# EAGLE design PWM_Board (EAGLE 7.1.0)
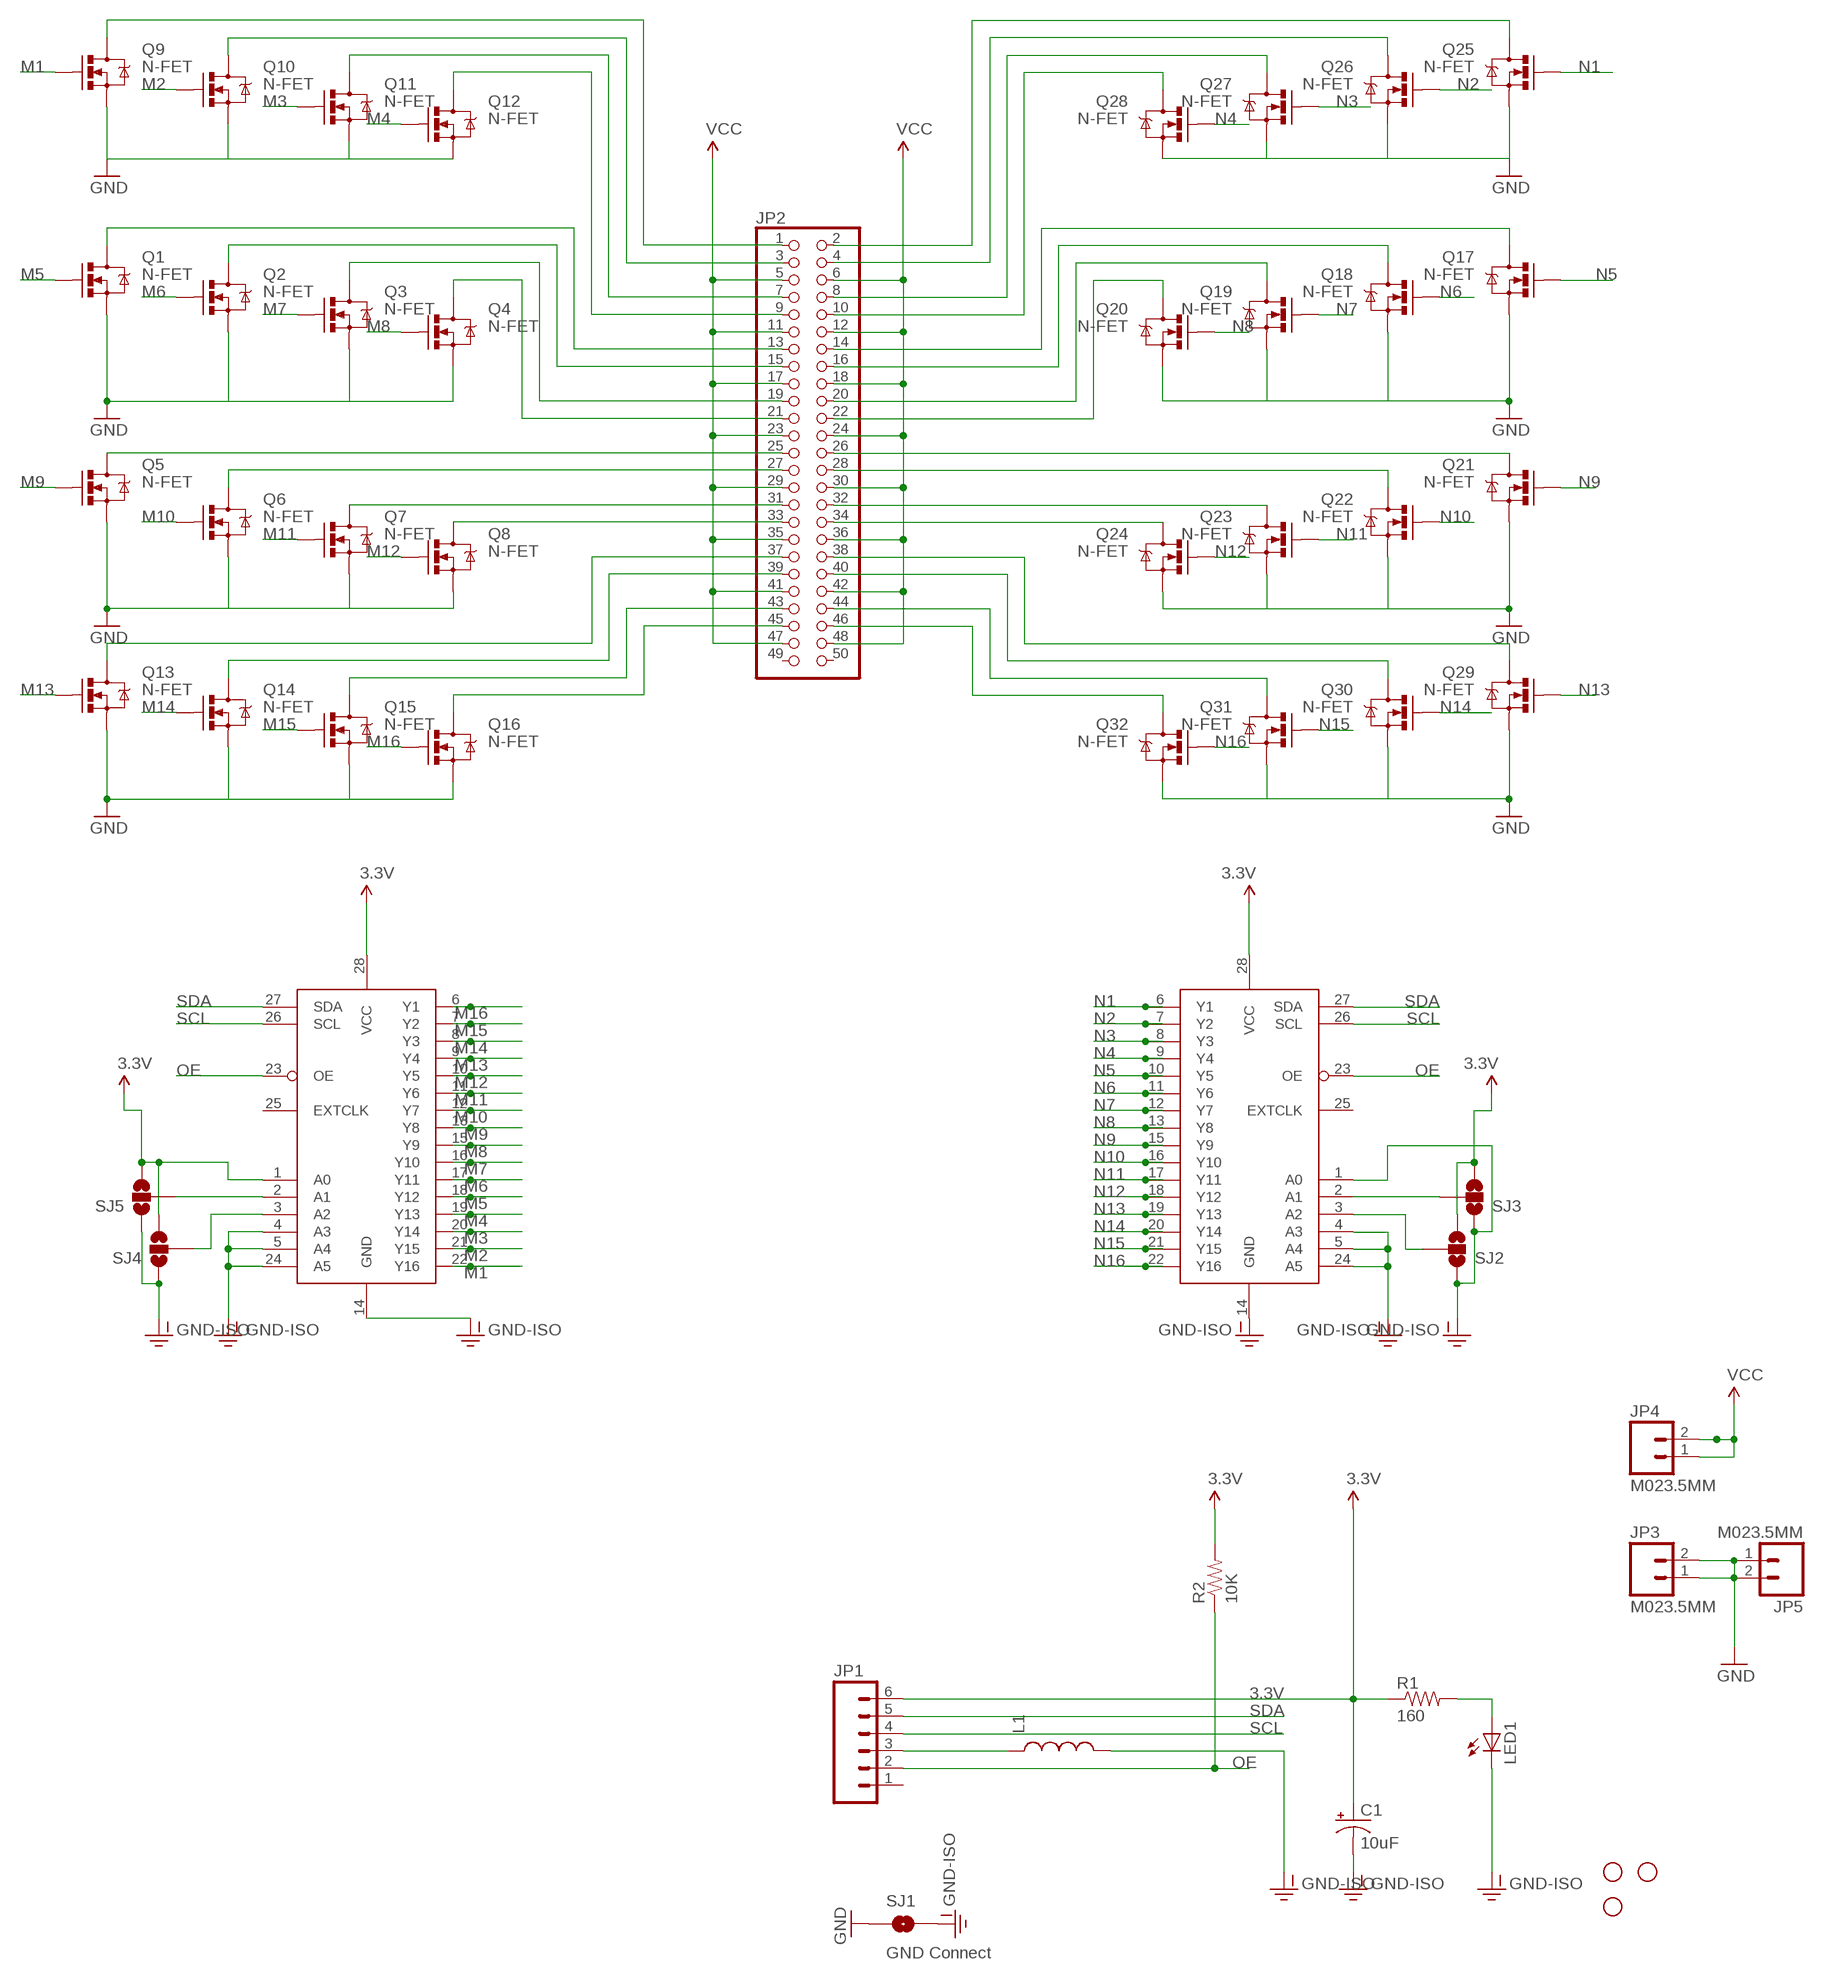
[diagram p0: schematic, sheet 1]

## Parts
C1  10uF  CAP_POL1206  [EIA3216]
JP1  M06POLAR  [MOLEX-1X6]
JP2  PINHD-2X25  [2X25]
JP3  M023.5MM  [SCREWTERMINAL-3.5MM-2]
JP4  M023.5MM  [SCREWTERMINAL-3.5MM-2]
JP5  M023.5MM  [SCREWTERMINAL-3.5MM-2]
L1  INDUCTOR1206H*  [INDUCTOR-1206]
LED1  LED-FKIT-1206  [FKIT-LED-1206]
Q1  N-FET  MOSFET-NCHANNELBSS138  [SOT23]
Q2  N-FET  MOSFET-NCHANNELBSS138  [SOT23]
Q3  N-FET  MOSFET-NCHANNELBSS138  [SOT23]
Q4  N-FET  MOSFET-NCHANNELBSS138  [SOT23]
Q5  N-FET  MOSFET-NCHANNELBSS138  [SOT23]
Q6  N-FET  MOSFET-NCHANNELBSS138  [SOT23]
Q7  N-FET  MOSFET-NCHANNELBSS138  [SOT23]
Q8  N-FET  MOSFET-NCHANNELBSS138  [SOT23]
Q9  N-FET  MOSFET-NCHANNELBSS138  [SOT23]
Q10  N-FET  MOSFET-NCHANNELBSS138  [SOT23]
Q11  N-FET  MOSFET-NCHANNELBSS138  [SOT23]
Q12  N-FET  MOSFET-NCHANNELBSS138  [SOT23]
Q13  N-FET  MOSFET-NCHANNELBSS138  [SOT23]
Q14  N-FET  MOSFET-NCHANNELBSS138  [SOT23]
Q15  N-FET  MOSFET-NCHANNELBSS138  [SOT23]
Q16  N-FET  MOSFET-NCHANNELBSS138  [SOT23]
Q17  N-FET  MOSFET-NCHANNELBSS138  [SOT23]
Q18  N-FET  MOSFET-NCHANNELBSS138  [SOT23]
Q19  N-FET  MOSFET-NCHANNELBSS138  [SOT23]
Q20  N-FET  MOSFET-NCHANNELBSS138  [SOT23]
Q21  N-FET  MOSFET-NCHANNELBSS138  [SOT23]
Q22  N-FET  MOSFET-NCHANNELBSS138  [SOT23]
Q23  N-FET  MOSFET-NCHANNELBSS138  [SOT23]
Q24  N-FET  MOSFET-NCHANNELBSS138  [SOT23]
Q25  N-FET  MOSFET-NCHANNELBSS138  [SOT23]
Q26  N-FET  MOSFET-NCHANNELBSS138  [SOT23]
Q27  N-FET  MOSFET-NCHANNELBSS138  [SOT23]
Q28  N-FET  MOSFET-NCHANNELBSS138  [SOT23]
Q29  N-FET  MOSFET-NCHANNELBSS138  [SOT23]
Q30  N-FET  MOSFET-NCHANNELBSS138  [SOT23]
Q31  N-FET  MOSFET-NCHANNELBSS138  [SOT23]
Q32  N-FET  MOSFET-NCHANNELBSS138  [SOT23]
R1  160  RESISTOR1206  [1206]
R2  10K  RESISTOR1206  [1206]
SJ1  GND Connect  SOLDERJUMPERNC  [SJ_2S]
SJ2  SOLDERJUMPER_2WAYS  [SJ_3]
SJ3  SOLDERJUMPER_2WAYS  [SJ_3]
SJ4  SOLDERJUMPER_2WAYS  [SJ_3]
SJ5  SOLDERJUMPER_2WAYS  [SJ_3]
STANDOFF1  STAND-OFF  [STAND-OFF]
STANDOFF3  STAND-OFF  [STAND-OFF]
STANDOFF4  STAND-OFF  [STAND-OFF]
U$2  PCA9685  [TSSOP28]
U$3  PCA9685  [TSSOP28]

## Nets
3.3V: C1.A(+) JP1.6 R1.1 R2.2 SJ2.3 SJ3.3 SJ4.3 SJ5.3 U$2.28(VCC) U$3.1(A0) U$3.28(VCC)
GND: JP3.1 JP3.2 JP5.1 JP5.2 Q1.2(S) Q2.2(S) Q3.2(S) Q4.2(S) Q5.2(S) Q6.2(S) Q7.2(S) Q8.2(S) Q9.2(S) Q10.2(S) Q11.2(S) Q12.2(S) Q13.2(S) Q14.2(S) Q15.2(S) Q16.2(S) Q17.2(S) Q18.2(S) Q19.2(S) Q20.2(S) Q21.2(S) Q22.2(S) Q23.2(S) Q24.2(S) Q25.2(S) Q26.2(S) Q27.2(S) Q28.2(S) Q29.2(S) Q30.2(S) Q31.2(S) Q32.2(S) SJ1.1
GND-ISO: C1.C(-) L1.P$2 LED1.C SJ1.2 SJ2.1 SJ3.1 SJ4.1 SJ5.1 U$2.1(A0) U$2.4(A3) U$2.5(A4) U$2.14(GND) U$2.24(A5) U$3.4(A3) U$3.5(A4) U$3.14(GND) U$3.24(A5)
M1: Q9.1(G) U$3.22(Y16)
M2: Q10.1(G) U$3.21(Y15)
M3: Q11.1(G) U$3.20(Y14)
M4: Q12.1(G) U$3.19(Y13)
M5: Q1.1(G) U$3.18(Y12)
M6: Q2.1(G) U$3.17(Y11)
M7: Q3.1(G) U$3.16(Y10)
M8: Q4.1(G) U$3.15(Y9)
M9: Q5.1(G) U$3.13(Y8)
M10: Q6.1(G) U$3.12(Y7)
M11: Q7.1(G) U$3.11(Y6)
M12: Q8.1(G) U$3.10(Y5)
M13: Q13.1(G) U$3.9(Y4)
M14: Q14.1(G) U$3.8(Y3)
M15: Q15.1(G) U$3.7(Y2)
M16: Q16.1(G) U$3.6(Y1)
N1: Q25.1(G) U$2.6(Y1)
N2: Q26.1(G) U$2.7(Y2)
N3: Q27.1(G) U$2.8(Y3)
N4: Q28.1(G) U$2.9(Y4)
N5: Q17.1(G) U$2.10(Y5)
N6: Q18.1(G) U$2.11(Y6)
N7: Q19.1(G) U$2.12(Y7)
N8: Q20.1(G) U$2.13(Y8)
N9: Q21.1(G) U$2.15(Y9)
N10: Q22.1(G) U$2.16(Y10)
N11: Q23.1(G) U$2.17(Y11)
N12: Q24.1(G) U$2.18(Y12)
N13: Q29.1(G) U$2.19(Y13)
N14: Q30.1(G) U$2.20(Y14)
N15: Q31.1(G) U$2.21(Y15)
N16: Q32.1(G) U$2.22(Y16)
N$1: JP1.3 L1.P$1
N$2: JP2.1 Q9.3(D)
N$3: JP2.3 Q10.3(D)
N$4: JP2.7 Q11.3(D)
N$5: JP2.9 Q12.3(D)
N$6: JP2.13 Q1.3(D)
N$7: JP2.15 Q2.3(D)
N$8: JP2.19 Q3.3(D)
N$9: JP2.21 Q4.3(D)
N$10: JP2.25 Q5.3(D)
N$11: LED1.A R1.2
N$12: JP2.27 Q6.3(D)
N$13: JP2.31 Q7.3(D)
N$14: JP2.33 Q8.3(D)
N$15: JP2.37 Q13.3(D)
N$16: JP2.39 Q14.3(D)
N$17: JP2.43 Q15.3(D)
N$18: JP2.45 Q16.3(D)
N$23: JP2.2 Q25.3(D)
N$24: JP2.4 Q26.3(D)
N$25: JP2.8 Q27.3(D)
N$26: JP2.10 Q28.3(D)
N$27: JP2.14 Q17.3(D)
N$28: JP2.16 Q18.3(D)
N$29: JP2.20 Q19.3(D)
N$30: JP2.22 Q20.3(D)
N$31: JP2.26 Q21.3(D)
N$32: JP2.28 Q22.3(D)
N$33: JP2.32 Q23.3(D)
N$34: JP2.34 Q24.3(D)
N$35: JP2.38 Q29.3(D)
N$36: JP2.40 Q30.3(D)
N$37: JP2.44 Q31.3(D)
N$38: JP2.46 Q32.3(D)
N$44: SJ3.2 U$2.2(A1)
N$45: SJ2.2 U$2.3(A2)
N$47: SJ5.2 U$3.2(A1)
N$48: SJ4.2 U$3.3(A2)
OE: JP1.2 R2.1 U$2.23(OE) U$3.23(OE)
SCL: JP1.4 U$2.26(SCL) U$3.26(SCL)
SDA: JP1.5 U$2.27(SDA) U$3.27(SDA)
VCC: JP2.5 JP2.6 JP2.11 JP2.12 JP2.17 JP2.18 JP2.23 JP2.24 JP2.29 JP2.30 JP2.35 JP2.36 JP2.41 JP2.42 JP2.47 JP2.48 JP4.1 JP4.2
Unconnected: JP1.1 JP2.49 JP2.50 U$2.25(EXTCLK) U$3.25(EXTCLK)

## Library data of the parts
C1 = 1_SparkFun-Capacitors:CAP_POL: Capacitor Polarized These are standard SMD and PTH capacitors. Normally 10uF, 47uF, and 100uF in electrolytic and tantalum varieties. Always verify the external diameter of the through hole cap, it varies with capacity, voltage, and manufacturer. The EIA devices should be standard.
JP1 = 1_SparkFun-Connectors:M06: Header 6 Standard 6-pin 0.1" header. Use with straight break away headers (SKU : PRT-00116), right angle break away headers (PRT-00553), swiss pins (PRT-00743), machine pins (PRT-00117), and female headers (PRT-00115). Molex polarized connector foot print use with SKU : PRT-08094 with associated crimp pins and housings. NOTES ON THE VARIANTS LOCK and LOCK_LONGPADS... This footprint was designed to help hold the alignment of a through-hole component (i.e. 6-pin header) while soldering it into place. You may notice that each hole has been shifted either up or down by 0.005 of an inch from it's more standard position (which is a perfectly straight line). This slight alteration caused the pins (the squares in the middle) to touch the edges of the holes. Because they are alternating, it causes a "brace" to hold the component in place. 0.005 has proven to be the perfect amount of "off-center" position when using our standard breakaway headers. Although looks a little odd when you look at the bare footprint, once you have a header in there, the alteration is very hard to notice. Also,if you push a header all the way into place, it is covered up entirely on the bottom side. This idea of altering the position of holes to aid alignment will be further integrated into the Sparkfun Library for other footprints. It can help hold any component with 3 or more connection pins.
JP2 = pinhead:PINHD-2X25: PIN HEADER
JP3-JP5 = 1_SparkFun-Connectors:M02: Standard 2-pin 0.1" header. Use with - straight break away headers ( PRT-00116) - right angle break away headers (PRT-00553) - swiss pins (PRT-00743) - machine pins (PRT-00117) - female headers (PRT-00115) Molex polarized connector foot print use with: PRT-08233 with associated crimp pins and housings. 2.54_SCREWTERM for use with PRT-10571. 3.5mm Screw Terminal footprints for PRT-08084 5mm Screw Terminal footprints for use with PRT-08433
L1 = 1_SparkFun-Passives:INDUCTOR: Inductors Basic Inductor/Choke - 0603 and 1206. Footprints are not proven and vary greatly between part numbers. SRN6045- 33uH, 20% 1.4A SDR0403-560KL - 56uH, 10%, 500mA RMS/740mA peak
LED1 = 1_SparkFun-LED:LED: LEDs Standard schematic elements and footprints for 5mm, 3mm, 1206, and 0603 sized LEDs. 5mm - Spark Fun Electronics SKU : COM-00529 (and others)
Q1-Q32 = 1_SparkFun-DiscreteSemi:MOSFET-NCHANNEL: Common NMOSFET Parts MFG P/N Store ID Prod ID FDD8780 TRANS-09984 SI7820DN TRANS-11055 FDS6630A IC-08089 2N7002PW TRANS-11151 FQP30N06L COM-10213 TRANS-10060 BSS123LT1G TRANS-08345 BSS138 TRANS-00830 BS170 2N7000; PROD_ID: TRANS-00830
R1 R2 = 1_SparkFun-Resistors:RESISTOR: Resistor Basic schematic elements and footprints for 0603, 1206, and PTH resistors.
SJ1 = 1_SparkFun-Passives:SOLDERJUMPER: Solder Jumper Standard SMD solder jumper. Used to automate production. Two varients : Normally Open and Normally Closed are the same, but have different paste layers. NC will have a large amount of paste and should jumper during reflow.
SJ2-SJ5 = 1_SparkFun-Passives:SOLDERJUMPER_2WAY: Solder Jumper 2 way solder jumper
STANDOFF1 STANDOFF3 STANDOFF4 = 1_SparkFun-Electromechanical:STAND-OFF: #4 Stand Off This is the mechanical footprint for a #4 phillips button head screw. Use the keepout ring to avoid running the screw head into surrounding components. SKU : PRT-00447
U$2 U$3 = 0_Tristan's_Lib:PCA9685

## Board
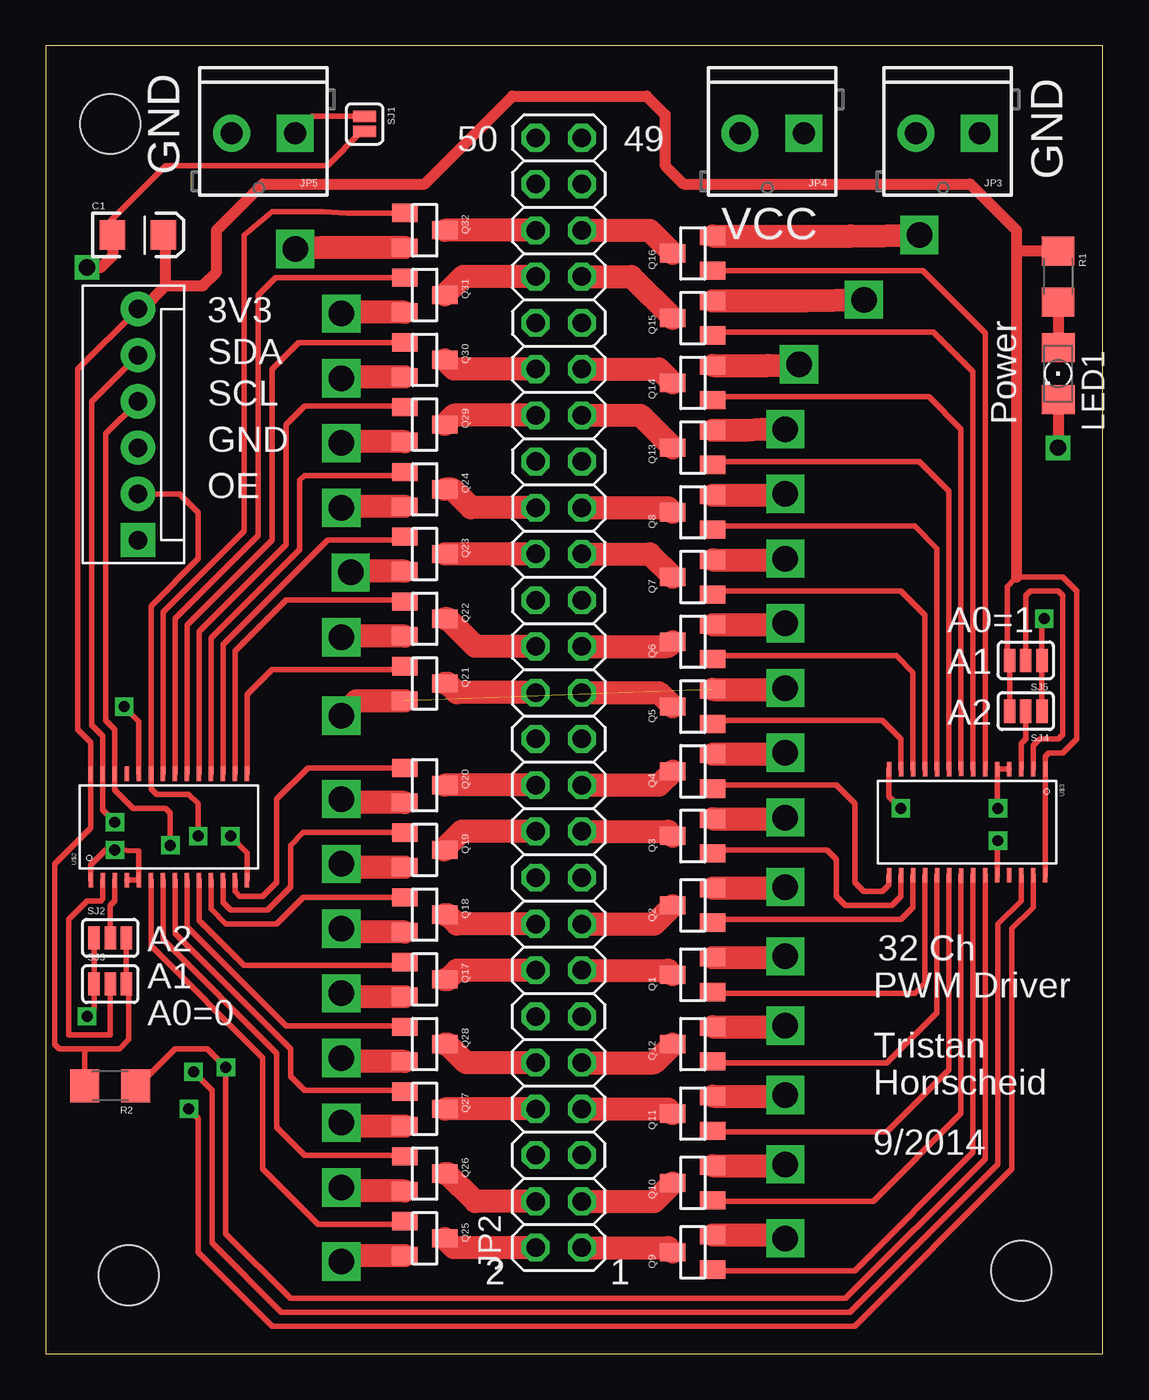
[diagram p1: board, top side]
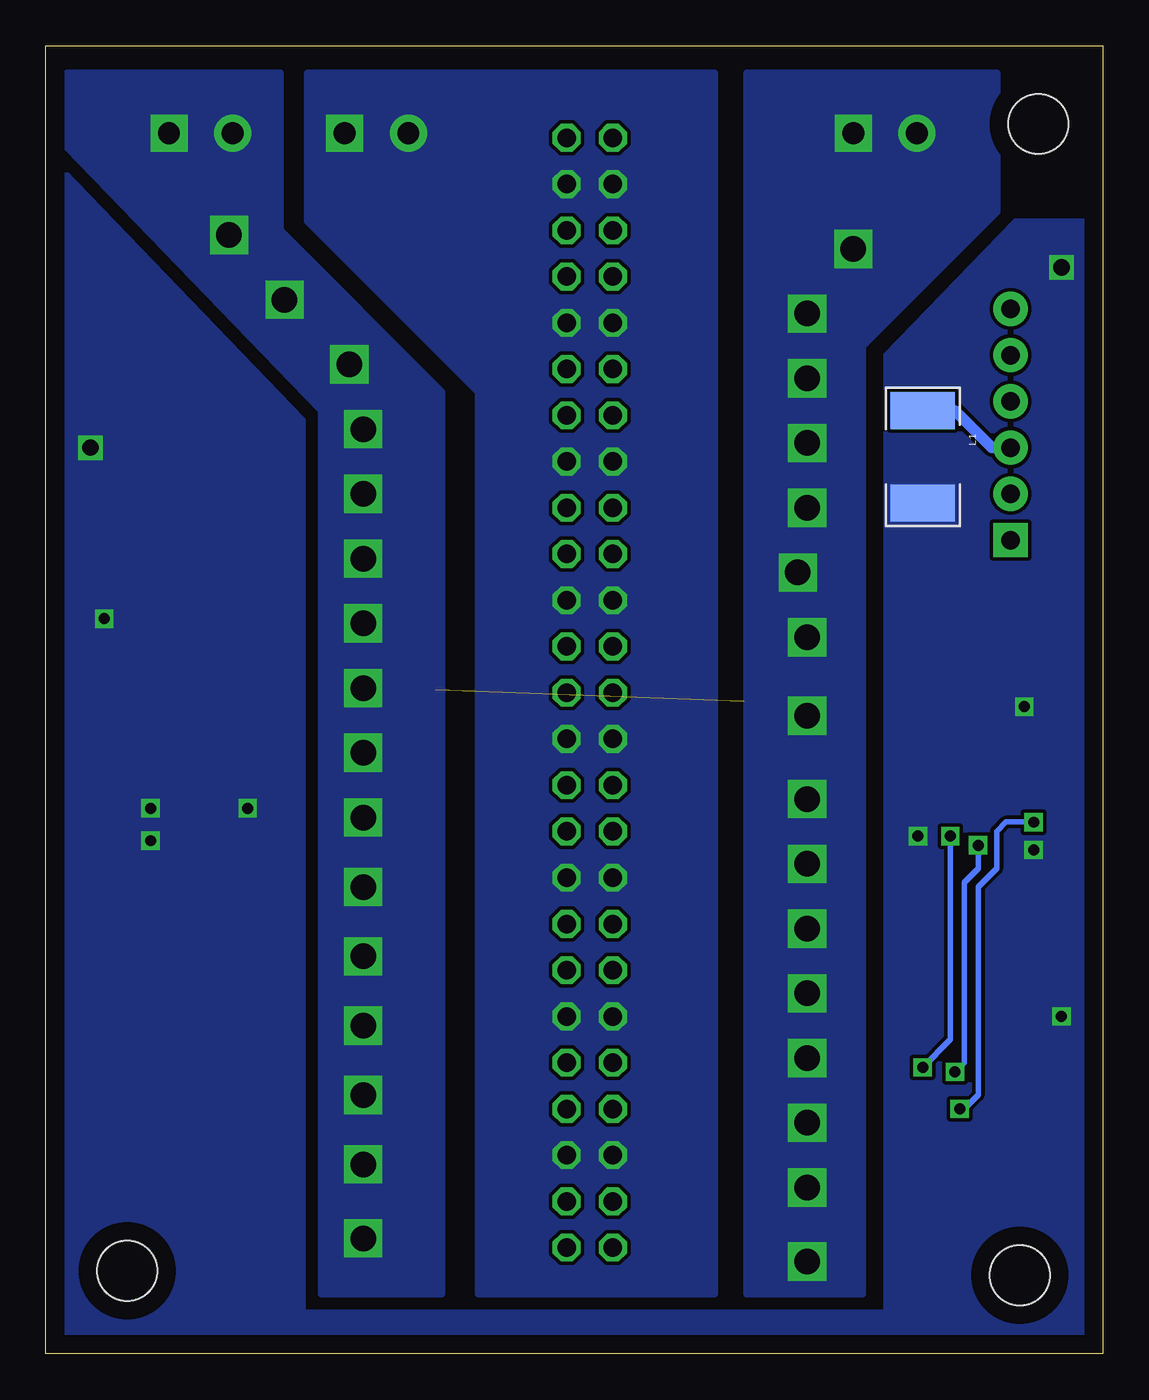
[diagram p2: board, bottom side, seen from below]

Size 58.09 x 71.87 mm. Coordinates in mm from the lower left corner, seen from the top.
Outline: 0,0 58.09,0 58.09,71.87 0,71.87 0,0
Copper layers (1*16): Top 0.035mm / dielectric 1.5mm / Bottom 0.035mm
Design rules "default": minimum track width 10mil, minimum drill 24mil, track to track 8mil, track to pad 8mil, pad to pad 8mil, via to via 8mil, smd to smd 8mil, copper to edge 40mil, drill to drill 8mil, minimum pad ring 10mil, minimum via ring 8mil, stop-mask expansion 4mil, vias tented up to drill 0mil, thermal gap 10mil

### Footprints (pad centres in the part's own frame; a part is rotated, then mirrored left to right if it is on the bottom)
EIA3216 = smd 1.4 x 1.6: A 1.4,0; C -1.4,0
MOLEX-1X6 = drill 1.016 pad 1.88 square: 1 0,0 | drill 1.016 pad 1.88: 2 2.54,0; 3 5.08,0; 4 7.62,0; 5 10.16,0; 6 12.7,0
2X25 = drill 1.016 octagon: 1 -30.48,-1.27; 2 -30.48,1.27; 3 -27.94,-1.27; 4 -27.94,1.27; 5 -25.4,-1.27; 6 -25.4,1.27; 7 -22.86,-1.27; 8 -22.86,1.27; 9 -20.32,-1.27; 10 -20.32,1.27; 11 -17.78,-1.27; 12 -17.78,1.27; 13 -15.24,-1.27; 14 -15.24,1.27; 15 -12.7,-1.27; 16 -12.7,1.27; 17 -10.16,-1.27; 18 -10.16,1.27; 19 -7.62,-1.27; 20 -7.62,1.27; 21 -5.08,-1.27; 22 -5.08,1.27; 23 -2.54,-1.27; 24 -2.54,1.27; 25 0,-1.27; 26 0,1.27; 27 2.54,-1.27; 28 2.54,1.27; 29 5.08,-1.27; 30 5.08,1.27; 31 7.62,-1.27; 32 7.62,1.27; 33 10.16,-1.27; 34 10.16,1.27; 35 12.7,-1.27; 36 12.7,1.27; 37 15.24,-1.27; 38 15.24,1.27; 39 17.78,-1.27; 40 17.78,1.27; 41 20.32,-1.27; 42 20.32,1.27; 43 22.86,-1.27; 44 22.86,1.27; 45 25.4,-1.27; 46 25.4,1.27; 47 27.94,-1.27; 48 27.94,1.27; 49 30.48,-1.27; 50 30.48,1.27
SCREWTERMINAL-3.5MM-2 = drill 1.2 pad 2.032 square: 1 0,0 | drill 1.2 pad 2.032: 2 3.5,0
INDUCTOR-1206 = smd 2.032 x 3.556: P$1 -2.54,0; P$2 2.54,0
FKIT-LED-1206 = smd 1.6 x 1.803: A -1.422,0; C 1.422,0
SOT23 = smd 1 x 1.4: 1 -0.95,-1.1; 2 0.95,-1.1; 3 0,1.1
1206 = smd 1.6 x 1.8: 1 -1.4,0; 2 1.4,0
SJ_2S = smd 0.635 x 1.27: 1 -0.412,0; 2 0.412,0
SJ_3 = smd 0.635 x 1.27: 1 -0.889,0; 2 0,0; 3 0.889,0
STAND-OFF = hole 3.302: 0,0
TSSOP28 = smd 0.8 x 0.25: 1 -2.921,4.623; 2 -2.921,3.962; 3 -2.921,3.302; 4 -2.921,2.642; 5 -2.921,1.981; 6 -2.921,1.321; 7 -2.921,0.66; 8 -2.927,0; 9 -2.921,-0.66; 10 -2.921,-1.321; 11 -2.921,-1.981; 12 -2.921,-2.642; 13 -2.921,-3.302; 14 -2.921,-3.962; 15 2.921,-3.962; 16 2.921,-3.302; 17 2.921,-2.642; 18 2.921,-1.981; 19 2.921,-1.321; 20 2.921,-0.66; 21 2.927,0; 22 2.921,0.66; 23 2.921,1.321; 24 2.921,1.981; 25 2.921,2.642; 26 2.921,3.302; 27 2.921,3.962; 28 2.921,4.623

### Placement (x,y rotation side)
C1  5.08,61.47 0 top
JP1  5.08,44.7 90 top
JP2  28.19,36.32 90 top
JP3  51.31,67.06 180 top
JP4  41.66,67.06 180 top
JP5  13.72,67.06 180 top
L1  9.91,49.28 270 bottom
LED1  55.63,53.85 270 top
Q1  35.56,20.83 90 top
Q2  35.56,24.64 90 top
Q3  35.56,28.45 90 top
Q4  35.56,32 90 top
Q5  35.56,35.56 90 top
Q6  35.56,39.12 90 top
Q7  35.56,42.67 90 top
Q8  35.56,46.23 90 top
Q9  35.56,5.59 90 top
Q10  35.56,9.4 90 top
Q11  35.56,13.21 90 top
Q12  35.56,17.02 90 top
Q13  35.56,49.78 90 top
Q14  35.56,53.34 90 top
Q15  35.56,56.9 90 top
Q16  35.56,60.45 90 top
Q17  20.83,20.57 270 top
Q18  20.83,24.13 270 top
Q19  20.83,27.69 270 top
Q20  20.83,31.24 270 top
Q21  20.83,36.83 270 top
Q22  20.83,40.39 270 top
Q23  20.83,43.94 270 top
Q24  20.83,47.5 270 top
Q25  20.83,6.35 270 top
Q26  20.83,9.91 270 top
Q27  20.83,13.46 270 top
Q28  20.83,17.02 270 top
Q29  20.83,51.05 270 top
Q30  20.83,54.61 270 top
Q31  20.83,58.17 270 top
Q32  20.83,61.72 270 top
R1  55.63,59.18 270 top
R2  3.56,14.73 180 top
SJ1  17.53,67.56 270 top
SJ2  3.56,22.86 0 top
SJ3  3.56,20.32 0 top
SJ4  53.85,35.31 180 top
SJ5  53.85,38.1 180 top
STANDOFF1  4.57,4.32 0 top
STANDOFF3  53.59,4.57 0 top
STANDOFF4  3.56,67.56 0 top
U$2  7.11,28.96 90 top
U$3  50.29,29.21 270 top

### Tracks (layer width: path | path; a pad name or v marks a point on that pad's centre or on a via)
3.3V
  Top 0.305: SJ4.3 SJ5.3 52.83,38.23 52.83,42.16 53.34,42.67 55.88,42.67 56.64,41.91 56.64,33.78 55.88,33.02 55.12,33.02 54.91,32.82 U$3.1 U$3.28 | SJ2.3 SJ3.3 4.57,20.19 4.57,17.27 4.06,16.76 2.29,16.76 | JP1.6 1.78,54.1 1.78,34.29 2.49,33.58 U$2.28 2.49,28.91 0.51,26.92 0.51,17.02 0.76,16.76 2.29,16.76 | R2.2 2.16,16.63 2.29,16.76
  Top 0.61: JP1.6 5.33,57.4 6.6,58.67 | 6.6,58.67 6.6,61.34 C1.A | 6.6,58.67 8.64,58.67 9.4,59.44 9.4,61.72 11.94,64.26 20.83,64.26 25.65,69.09 33.02,69.09 34.04,68.07 34.04,65.28 35.05,64.26 50.8,64.26 53.34,61.72 53.34,60.71 | 53.34,60.71 53.34,42.67 | R1.1 53.46,60.58 53.34,60.71
GND  (via drill 1.4)  (1 unrouted)
  Top 0.305: SJ1.1 14.64,67.98 JP5.1
  Top 1.27: Q16.2 44.26,61.4 v48.01,61.47 | Q15.2 41.72,57.85 v44.96,57.91 | Q14.2 39.69,54.29 v41.4,54.36 | Q13.2 38.42,50.73 39.37,50.8 v40.64,50.8 | Q8.2 40.57,47.18 v40.64,47.24 | Q7.2 40.57,43.62 v40.64,43.69 | Q6.2 40.57,40.07 v40.64,40.13 | Q5.2 40.57,36.51 v40.64,36.58 | Q4.2 40.32,32.95 40.39,33.02 v40.64,33.02 | Q3.2 40.57,29.4 v40.64,29.46 | Q2.2 40.57,25.59 v40.64,25.65 | Q1.2 40.32,21.78 v40.64,21.84 | Q12.2 40.32,17.97 v40.64,18.03 | Q11.2 40.32,14.16 v40.64,14.22 | Q10.2 40.57,10.35 v40.64,10.41 | Q9.2 40.2,6.54 v40.64,6.35 | Q32.2 15.17,60.77 v13.72,60.71 | Q31.2 16.32,57.22 v16.26,57.15 | Q30.2 16.32,53.66 v16.26,53.59 | Q29.2 16.32,50.1 v16.26,50.04 | Q24.2 16.32,46.55 v16.26,46.48 | Q23.2 16.58,42.99 v16.76,42.93 | Q22.2 16.32,39.44 v16.26,39.37 | Q21.2 17.08,35.88 v16.26,35.05 | Q20.2 16.44,30.29 v16.26,30.48 | Q19.2 16.44,26.74 v16.26,26.92 | Q18.2 16.44,23.18 v16.26,23.37 | Q17.2 16.44,19.62 v16.26,19.81 | Q28.2 16.44,16.07 v16.26,16.26 | Q27.2 16.44,12.51 v16.26,12.7 | Q26.2 16.44,8.96 v16.26,9.14 | Q25.2 16.58,5.4 v16.26,5.08
  pour Bottom (no thermals): 36.32,3.3 36.32,52.83 45.21,61.72 45.21,70.36 56.9,70.36 56.9,66.29 42.93,51.82 42.93,3.3
  pour Bottom (no thermals): 5.84,70.36 19.56,70.36 19.56,3.3 13.21,3.3 13.21,55.37 5.84,62.74
GND-ISO  (via drill 0.6, 0.9)
  Top 0.305: U$3.4 U$3.5 52.27,30.02 v52.32,29.97 | U$2.14 11.07,27.53 v10.16,28.45 | SJ4.1 SJ5.1 54.74,40.26 v54.86,40.39 | U$2.4 U$2.5 5.13,27.64 v3.81,27.69 3.3,27.69 2.49,26.87 U$2.1 | U$2.24 5.13,34.75 v4.32,35.56 | v2.29,18.54 2.67,18.92 SJ3.1 SJ2.1 | U$3.14 46.33,30.63 v46.99,29.97 | U$3.24 52.27,28.14 v52.32,28.19 | SJ1.2 17.37,67.15 15.49,65.28 6.6,65.28 3.56,62.23 3.56,61.59 C1.C
  Top 0.61: C1.C 3.68,60.32 3.05,59.69 v2.29,59.69 | LED1.C v55.63,49.78
  pour Bottom (no thermals): 0.51,62.23 4.83,62.23 11.94,54.86 11.94,2.29 43.94,2.29 43.94,51.31 57.15,65.02 57.4,0.51 0.51,0.51
M1
  Top 0.305: U$3.22 50.95,11.07 44.45,4.57 36.73,4.57 Q9.1
M2
  Top 0.305: U$3.21 50.29,13.21 45.47,8.38 36.73,8.38 Q10.1
M3
  Top 0.305: U$3.20 49.63,15.6 46.23,12.19 36.73,12.19 Q11.1
M4
  Top 0.305: U$3.19 48.97,18.75 46.23,16 36.73,16 Q12.1
M5
  Top 0.305: U$3.18 48.31,20.37 47.75,19.81 36.73,19.81 Q1.1
M6
  Top 0.305: U$3.17 47.65,24.54 46.99,23.88 36.85,23.88 Q2.1
M7
  Top 0.305: U$3.16 46.99,25.15 46.48,24.64 43.94,24.64 43.43,25.15 43.43,27.18 42.93,27.69 36.85,27.69 Q3.1
M8
  Top 0.305: U$3.15 46.33,25.76 45.97,25.4 44.96,25.4 44.45,25.91 44.45,30.23 43.43,31.24 36.85,31.24 Q4.1
M9
  Top 0.305: U$3.13 46.99,33.78 45.97,34.8 36.85,34.8 Q5.1
M10
  Top 0.305: U$3.12 47.65,37.44 46.74,38.35 36.85,38.35 Q6.1
M11
  Top 0.305: U$3.11 48.31,40.59 46.99,41.91 36.85,41.91 Q7.1
M12
  Top 0.305: U$3.10 48.97,44.25 47.75,45.47 36.85,45.47 Q8.1
M13
  Top 0.305: U$3.9 49.63,47.4 48.01,49.02 36.85,49.02 Q13.1
M14
  Top 0.305: U$3.8 50.29,50.8 48.51,52.58 36.85,52.58 Q14.1
M15
  Top 0.305: U$3.7 50.95,53.95 48.77,56.13 36.85,56.13 Q15.1
M16
  Top 0.305: Q16.1 48.19,59.5 51.61,56.08 U$3.6
N1
  Top 0.305: U$2.6 5.79,22.4 11.94,16.26 11.94,10.16 14.99,7.11 19.54,7.11 Q25.1
N2
  Top 0.305: U$2.7 6.45,22.76 12.7,16.51 12.7,12.45 14.22,10.92 19.66,10.92 Q26.1
N3
  Top 0.305: U$2.8 7.11,23.11 13.46,16.76 13.46,15.24 14.22,14.48 19.66,14.48 Q27.1
N4
  Top 0.305: U$2.9 7.77,23.47 13.21,18.03 19.66,18.03 Q28.1
N5
  Top 0.305: U$2.10 8.43,23.82 10.92,21.34 19.54,21.34 Q17.1
N6
  Top 0.305: Q18.1 14.16,25.08 12.7,23.62 9.91,23.62 9.09,24.43 U$2.11
N7
  Top 0.305: Q19.1 14.16,28.64 13.46,27.94 13.46,25.65 12.19,24.38 10.16,24.38 9.75,24.79 U$2.12
N8
  Top 0.305: Q20.1 14.41,32.19 12.7,30.48 12.7,25.91 11.94,25.15 10.67,25.15 10.41,25.4 U$2.13
N9
  Top 0.305: U$2.15 11.07,36.22 12.45,37.59 19.54,37.59 Q21.1
N10
  Top 0.305: U$2.16 10.41,38.61 13.21,41.4 19.66,41.4 Q22.1
N11
  Top 0.305: U$2.17 9.75,38.96 15.49,44.7 19.54,44.7 Q23.1
N12
  Top 0.305: U$2.18 9.09,39.32 13.97,44.2 13.97,48.01 14.22,48.26 19.54,48.26 Q24.1
N13
  Top 0.305: U$2.19 8.43,39.67 13.21,44.45 13.21,51.05 14.22,52.07 19.66,52.07 Q29.1
N14
  Top 0.305: U$2.20 7.77,40.03 12.45,44.7 12.45,54.1 13.9,55.56 Q30.1
N15
  Top 0.305: Q31.1 12.63,59.12 11.68,58.17 11.68,44.96 7.11,40.39 U$2.21
N16
  Top 0.305: Q32.1 16.58,62.67 15.24,62.74 12.45,62.74 10.92,61.47 10.92,45.21 6.45,40.74 U$2.22
N$1
  Bottom 0.61: JP1.3 6.1,49.78 8.13,51.82 L1.P$1
N$2
  Top 1.27: JP2.1 34.21,5.84 Q9.3
N$3
  Top 1.27: JP2.3 33.44,8.38 Q10.3
N$4
  Top 1.27: JP2.7 34.21,13.46 Q11.3
N$5
  Top 1.27: JP2.9 33.44,16 Q12.3
N$6
  Top 1.27: JP2.13 34.21,21.08 Q1.3
N$7
  Top 1.27: JP2.15 33.44,23.62 Q2.3
N$8
  Top 1.27: JP2.19 34.21,28.7 Q3.3
N$9
  Top 1.27: JP2.21 33.7,31.24 Q4.3
N$10
  Top 1.27: JP2.25 33.7,36.32 Q5.3
N$11
  Top 0.61: R1.2 LED1.A
N$12
  Top 1.27: JP2.27 34.21,38.86 Q6.3
N$13
  Top 1.27: JP2.31 33.19,43.94 Q7.3
N$14
  Top 1.27: JP2.33 34.21,46.48 Q8.3
N$15
  Top 1.27: JP2.37 32.68,51.56 Q13.3
N$16
  Top 1.27: JP2.39 33.7,54.1 Q14.3
N$17
  Top 1.27: JP2.43 32.17,59.18 Q15.3
N$18
  Top 1.27: JP2.45 33.19,61.72 Q16.3
N$23
  Top 1.27: JP2.2 22.44,5.84 Q25.3
N$24
  Top 1.27: JP2.4 23.62,8.38 22.1,9.91 Q26.3
N$25
  Top 1.27: JP2.8 Q27.3
N$26
  Top 1.27: JP2.10 23.11,16 22.1,17.02 Q28.3
N$27
  Top 1.27: JP2.14 22.61,21.08 22.1,20.57 Q17.3
N$28
  Top 1.27: JP2.16 22.61,23.62 22.1,24.13 Q18.3
N$29
  Top 1.27: JP2.20 22.86,28.7 21.84,27.69 Q19.3
N$30
  Top 1.27: JP2.22 Q20.3
N$31
  Top 1.27: JP2.26 22.61,36.32 22.1,36.83 Q21.3
N$32
  Top 1.27: JP2.28 23.62,38.86 22.1,40.39 Q22.3
N$33
  Top 1.27: JP2.32 Q23.3
N$34
  Top 1.27: JP2.34 23.37,46.48 22.35,47.5 Q24.3
N$35
  Top 1.27: JP2.38 22.44,51.56 Q29.3
N$36
  Top 1.27: JP2.40 22.44,54.1 Q30.3
N$37
  Top 1.27: JP2.44 22.94,59.18 Q31.3
N$38
  Top 1.27: JP2.46 Q32.3
N$44
  Top 0.305: U$2.2 3.15,24.99 3.05,24.89 2.29,24.89 1.27,23.88 1.27,17.53 3.56,17.53 SJ3.2
N$45
  Top 0.305: SJ2.2 3.56,24.64 3.81,24.89 U$2.3
N$47
  Top 0.305: U$3.2 54.25,33.43 54.61,33.78 55.63,33.78 55.88,34.04 55.88,41.66 55.63,41.91 54.1,41.91 53.85,41.66 SJ5.2
N$48
  Top 0.305: U$3.3 53.59,33.53 53.85,33.78 SJ4.2
OE  (via drill 0.6)
  Top 0.305: JP1.2 7.37,47.24 8.38,46.23 8.38,43.69 5.79,41.1 U$2.23 5.79,31.04 6.1,30.73 7.87,30.73 8.38,30.23 v8.38,28.45 | U$3.23 51.61,10.72 43.94,3.05 13.46,3.05 9.91,6.6 v9.91,15.75 8.89,16.76 7.11,16.76 5.08,14.73 R2.1
  Bottom 0.305: v8.38,28.45 8.38,17.27 v9.91,15.75
SCL  (via drill 0.6)
  Top 0.305: JP1.4 3.3,50.55 3.3,34.8 3.81,34.29 U$2.26 3.81,30.99 4.83,29.97 6.6,29.97 6.86,29.72 v6.86,27.94 | v8.13,15.49 9.14,14.48 9.14,6.1 12.95,2.29 44.2,2.29 52.32,10.41 52.32,23.62 53.59,24.89 U$3.26
  Bottom 0.305: v6.86,27.94 6.86,26.67 7.62,25.91 7.62,16 v8.13,15.49
SDA  (via drill 0.6)
  Top 0.305: JP1.5 2.54,52.32 2.54,34.54 3.15,33.93 U$2.27 3.15,29.87 v3.81,29.21 | v7.87,13.46 8.38,12.95 8.38,5.59 12.45,1.52 44.45,1.52 53.09,10.16 53.09,23.37 54.25,24.54 U$3.27
  Bottom 0.305: v3.81,29.21 5.33,29.21 5.84,28.7 5.84,26.67 6.86,25.65 6.86,14.22 7.62,13.46 v7.87,13.46
VCC
  pour Bottom (no thermals): 21.34,70.36 43.69,70.36 43.69,62.23 34.29,52.83 34.29,3.3 21.34,3.3

### Text on the board
tPlace: 50 | 49 | GND | GND | VCC | 3V3 | SDA | SCL | Power | GND | OE | A0=1 | A1 | A2 | A2 | 32 Ch | A1 | PWM Driver | A0=0 | Tristan | Honscheid | 9/2014 | 2 | 1